# Altium project ActiveRoute.PrjPcb
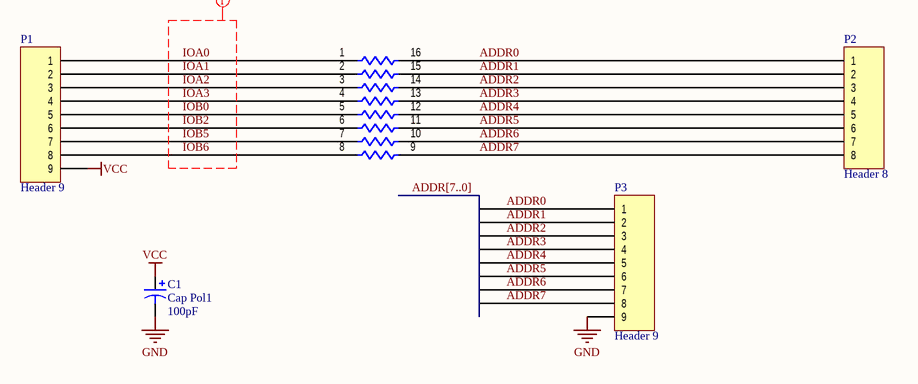
[diagram p0: ActiveRoute SCH.SchDoc]
1 sheet, 5 parts. Net scope: global (net labels, ports and power ports of the same name join across sheets).
Board file: ActiveRoute PCB.PcbDoc

## Sheet ActiveRoute SCH.SchDoc
size 431 x 279 mm; Organization: Altium Limited; Address1: L3, 12a Rodborough Rd; Address2: Frenchs Forest; Address3: NSW; Address4: Australia 2086

### Parts
C1  Cap Pol1  value 100pF  [RB7.6-15]
P1  Header 9  [HDR1X9]
P2  Header 8  [HDR1X8]
P3  Header 9  [HDR1X9]
R1  Res Pack1  [SOIC16_N]  (value not drawn)  (parts A,B,C,D,E,F,G,H of 8)

### Nets
GND: C1.2 P3.9
VCC: C1.1 P1.9
ADDR0: P2.1 P3.1 R1.16
ADDR1: P2.2 P3.2 R1.15
ADDR2: P2.3 P3.3 R1.14
ADDR3: P2.4 P3.4 R1.13
ADDR4: P2.5 P3.5 R1.12
ADDR5: P2.6 P3.6 R1.11
ADDR6: P2.7 P3.7 R1.10
ADDR7: P2.8 P3.8 R1.9
IOA0: P1.1 R1.1
IOA1: P1.2 R1.2
IOA2: P1.3 R1.3
IOA3: P1.4 R1.4
IOB0: P1.5 R1.5
IOB2: P1.6 R1.6
IOB5: P1.7 R1.7
IOB6: P1.8 R1.8

### Buses and harness runs
bus ADDR[7..0]

### Layout directives
net class P1nets: IOA0, IOA1, IOA2, IOA3, IOB0, IOB2, IOB5, IOB6

### Notes on the sheet
- 8
- 7
- 6
- 5
- 4
- 3
- DWG. NO.
- REV.
- SHT.
- 2
- 1
- THIS DOCUMENT AND THE DATA DISCLOSED HEREIN OR HEREWITH IS THE PROPERTY OF ALTIUM LIMITED AND MAY BE FREELY DISTRIBUTED IN WHOLE. NO RIGHTS ARE RESERVED OR EXPRESS OR IMPLIED WARANTEE GIVEN.
- REVISION
- DESCRIPTION
- DATE
- APPROVED
- F
- E
- D
- C
- B
- ENG:
- APPROVALS
- PROJECT
- A
- DSN:
- CHK:
- REFERENCE DOCUMENTS
- PROJECT REVISION:
- TITLE
- DOCUMENT REVISION:
- DESIGN ITEM:
- BOM:
- FAB DWG:
- PCB DWG:
- ASSY DWG:
- SCALE:
- SIZE
- CAGE CODE
- FILE NAME
- DWG NO.
- SHEET
- OF
- REV

### Library data of the parts
C1 = Cap Pol1: Polarized Capacitor (Radial); Published: 8-Jun-2000; LatestRevisionDate: 17-Jul-2002; LatestRevisionNote: Re-released for DXP Platform.; PackageReference: RB7.6-15; Publisher: Altium Limited; PackageDescription: Polarized Capacitor (Radial); 2 Leads
P1 P3 = Header 9: Header, 9-Pin; LatestRevisionDate: 17-Jul-2002; LatestRevisionNote: Re-released for DXP Platform.; Publisher: Altium Limited
P2 = Header 8: Header, 8-Pin; LatestRevisionDate: 17-Jul-2002; LatestRevisionNote: Re-released for DXP Platform.; Publisher: Altium Limited
R1 = Res Pack1: Isolated Resistor Network - Parts; Sim Note: Enter the Resistance value into parameter field.; Value: 1K; Published: 24-Mar-1999; LatestRevisionDate: 29-May-2009; LatestRevisionNote: IPC-7351 Footprint Added.; PackageReference: SOIC16; Publisher: Altium Limited; PackageDescription: 16-Pin Small Outline Integrated Circuit 1.27 mm Pitch; Code_JEDEC: MS-012-AC; Code_IPC: SOIC127P600-16